# EAGLE schematic ai_breakout_ft2323RL (EAGLE 6.5.0)
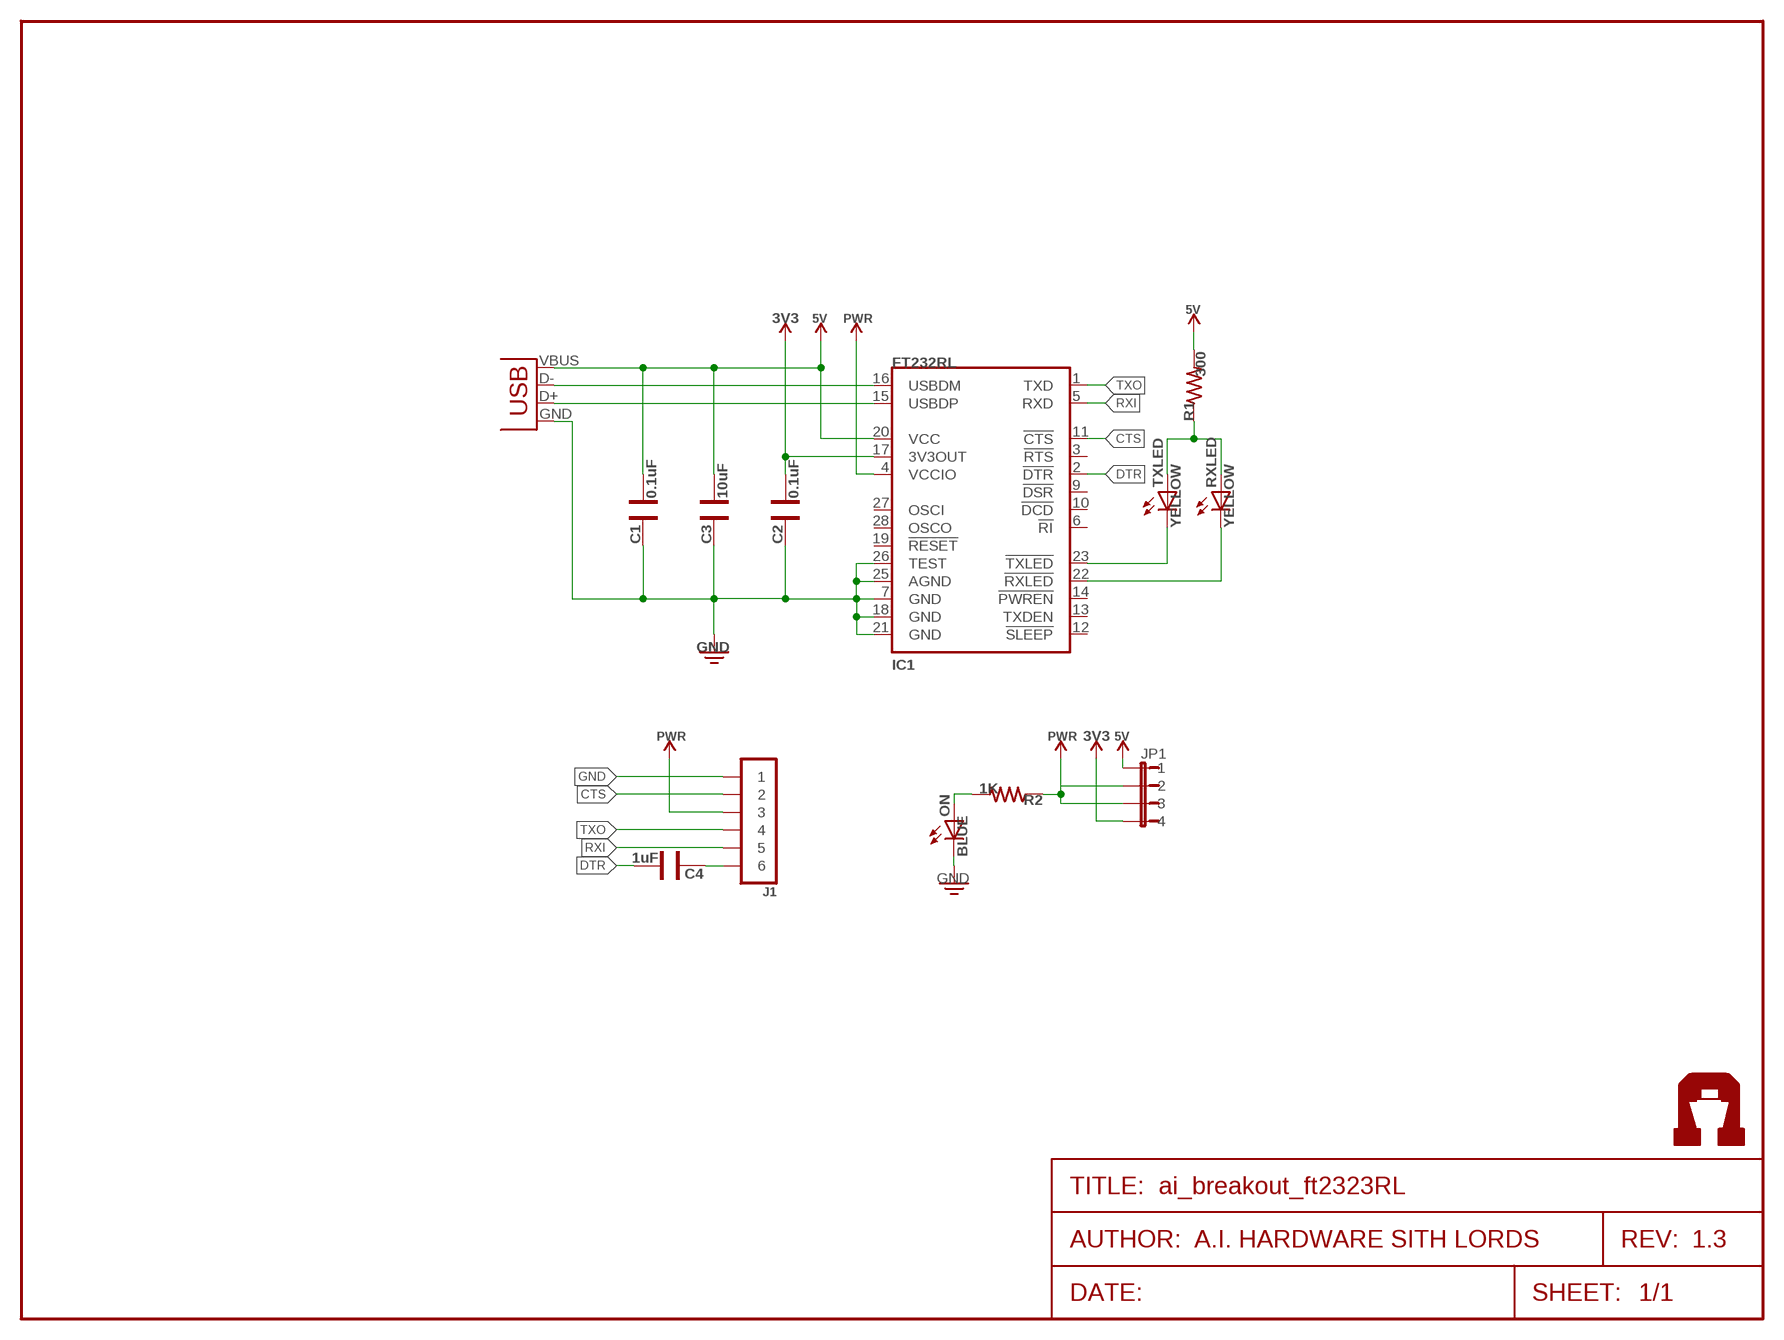
[diagram p0: schematic, sheet 1]
FRAME1 (FRAME-LETTER): AUTHOR: A.I. HARDWARE SITH LORDS; REV: 1.3

## Parts
C1  0.1uF  CAP0603  [CAP-0603]
C2  0.1uF  CAP0603  [CAP-0603]
C3  10uF  CAP0603  [CAP-0603]
C4  1uF  CAP0603  [CAP-0603]
IC1  FT2332RL  [SSOP28-LD]
J1  1X06LONG  [1X06-LONG]
JP1  1X04-PJ  [1X04]
ON  BLUE  LED0603  [LED-0603]
R1  300  RES0603  [RES-0603]
R2  1K  RES0603  [RES-0603]
RXLED  YELLOW  LED0603  [LED-0603]
TXLED  YELLOW  LED0603  [LED-0603]
U$3  AI-LOGOL  [AI-LOGO-L]
USB1  USBMICROB-TH  [USB-MICROB-TH]

## Nets
3V3 [power]: C2.1 IC1.17(3V3OUT) JP1.4
5V [power]: C1.1 C3.1 IC1.20(VCC) JP1.1 R1.2 USB1.VBUS
CTS: IC1.11(!CTS) J1.2
DTR: C4.1 IC1.2(!DTR)
GND [power]: C1.2 C2.2 C3.2 IC1.7(GND) IC1.18(GND) IC1.21(GND) IC1.25(AGND) IC1.26(TEST) J1.1 ON.C USB1.GND
N$1: IC1.23(!TXLED) TXLED.C
N$2: IC1.22(!RXLED) RXLED.C
N$3: IC1.16(USBDM) USB1.D-
N$4: IC1.15(USBDP) USB1.D+
N$5: ON.A R2.2
N$6: R1.1 RXLED.A TXLED.A
N$7: C4.2 J1.6
PWR [power]: IC1.4(VCCIO) J1.3 JP1.2 JP1.3 R2.1
RXI: IC1.5(RXD) J1.5
TXO: IC1.1(TXD) J1.4
Unconnected: IC1.3(!RTS) IC1.6(!RI) IC1.9(!DSR) IC1.10(!DCD) IC1.12(!SLEEP) IC1.13(TXDEN) IC1.14(!PWREN) IC1.19(!RESET) IC1.27(OSCI) IC1.28(OSCO)

## Library data of the parts
C1-C4 = Ai_Passives:CAP
IC1 = Ai_IC:FT2332R
J1 = Ai_Connectors:1X06
JP1 = Ai_Connectors:1X04-PJ
ON RXLED TXLED = Ai_LED:LED
R1 R2 = Ai_Passives:RES
U$3 = Ai_Miscellany:AI-LOGO
USB1 = Ai_Connectors:USB

## Net classes
0 default: width 0.254 mm
1 power: width 0.356 mm